# EasyEDA Pro project ministm32.eprj

# Schematic Schematic1
Create Date: 2023-02-22; Page Name: P1; Project Name: ministm32; Schematic Name: Schematic1; Update Date: 2023-02-23; Company: 嘉立创EDA; Page Size: A3; Version: V1.0
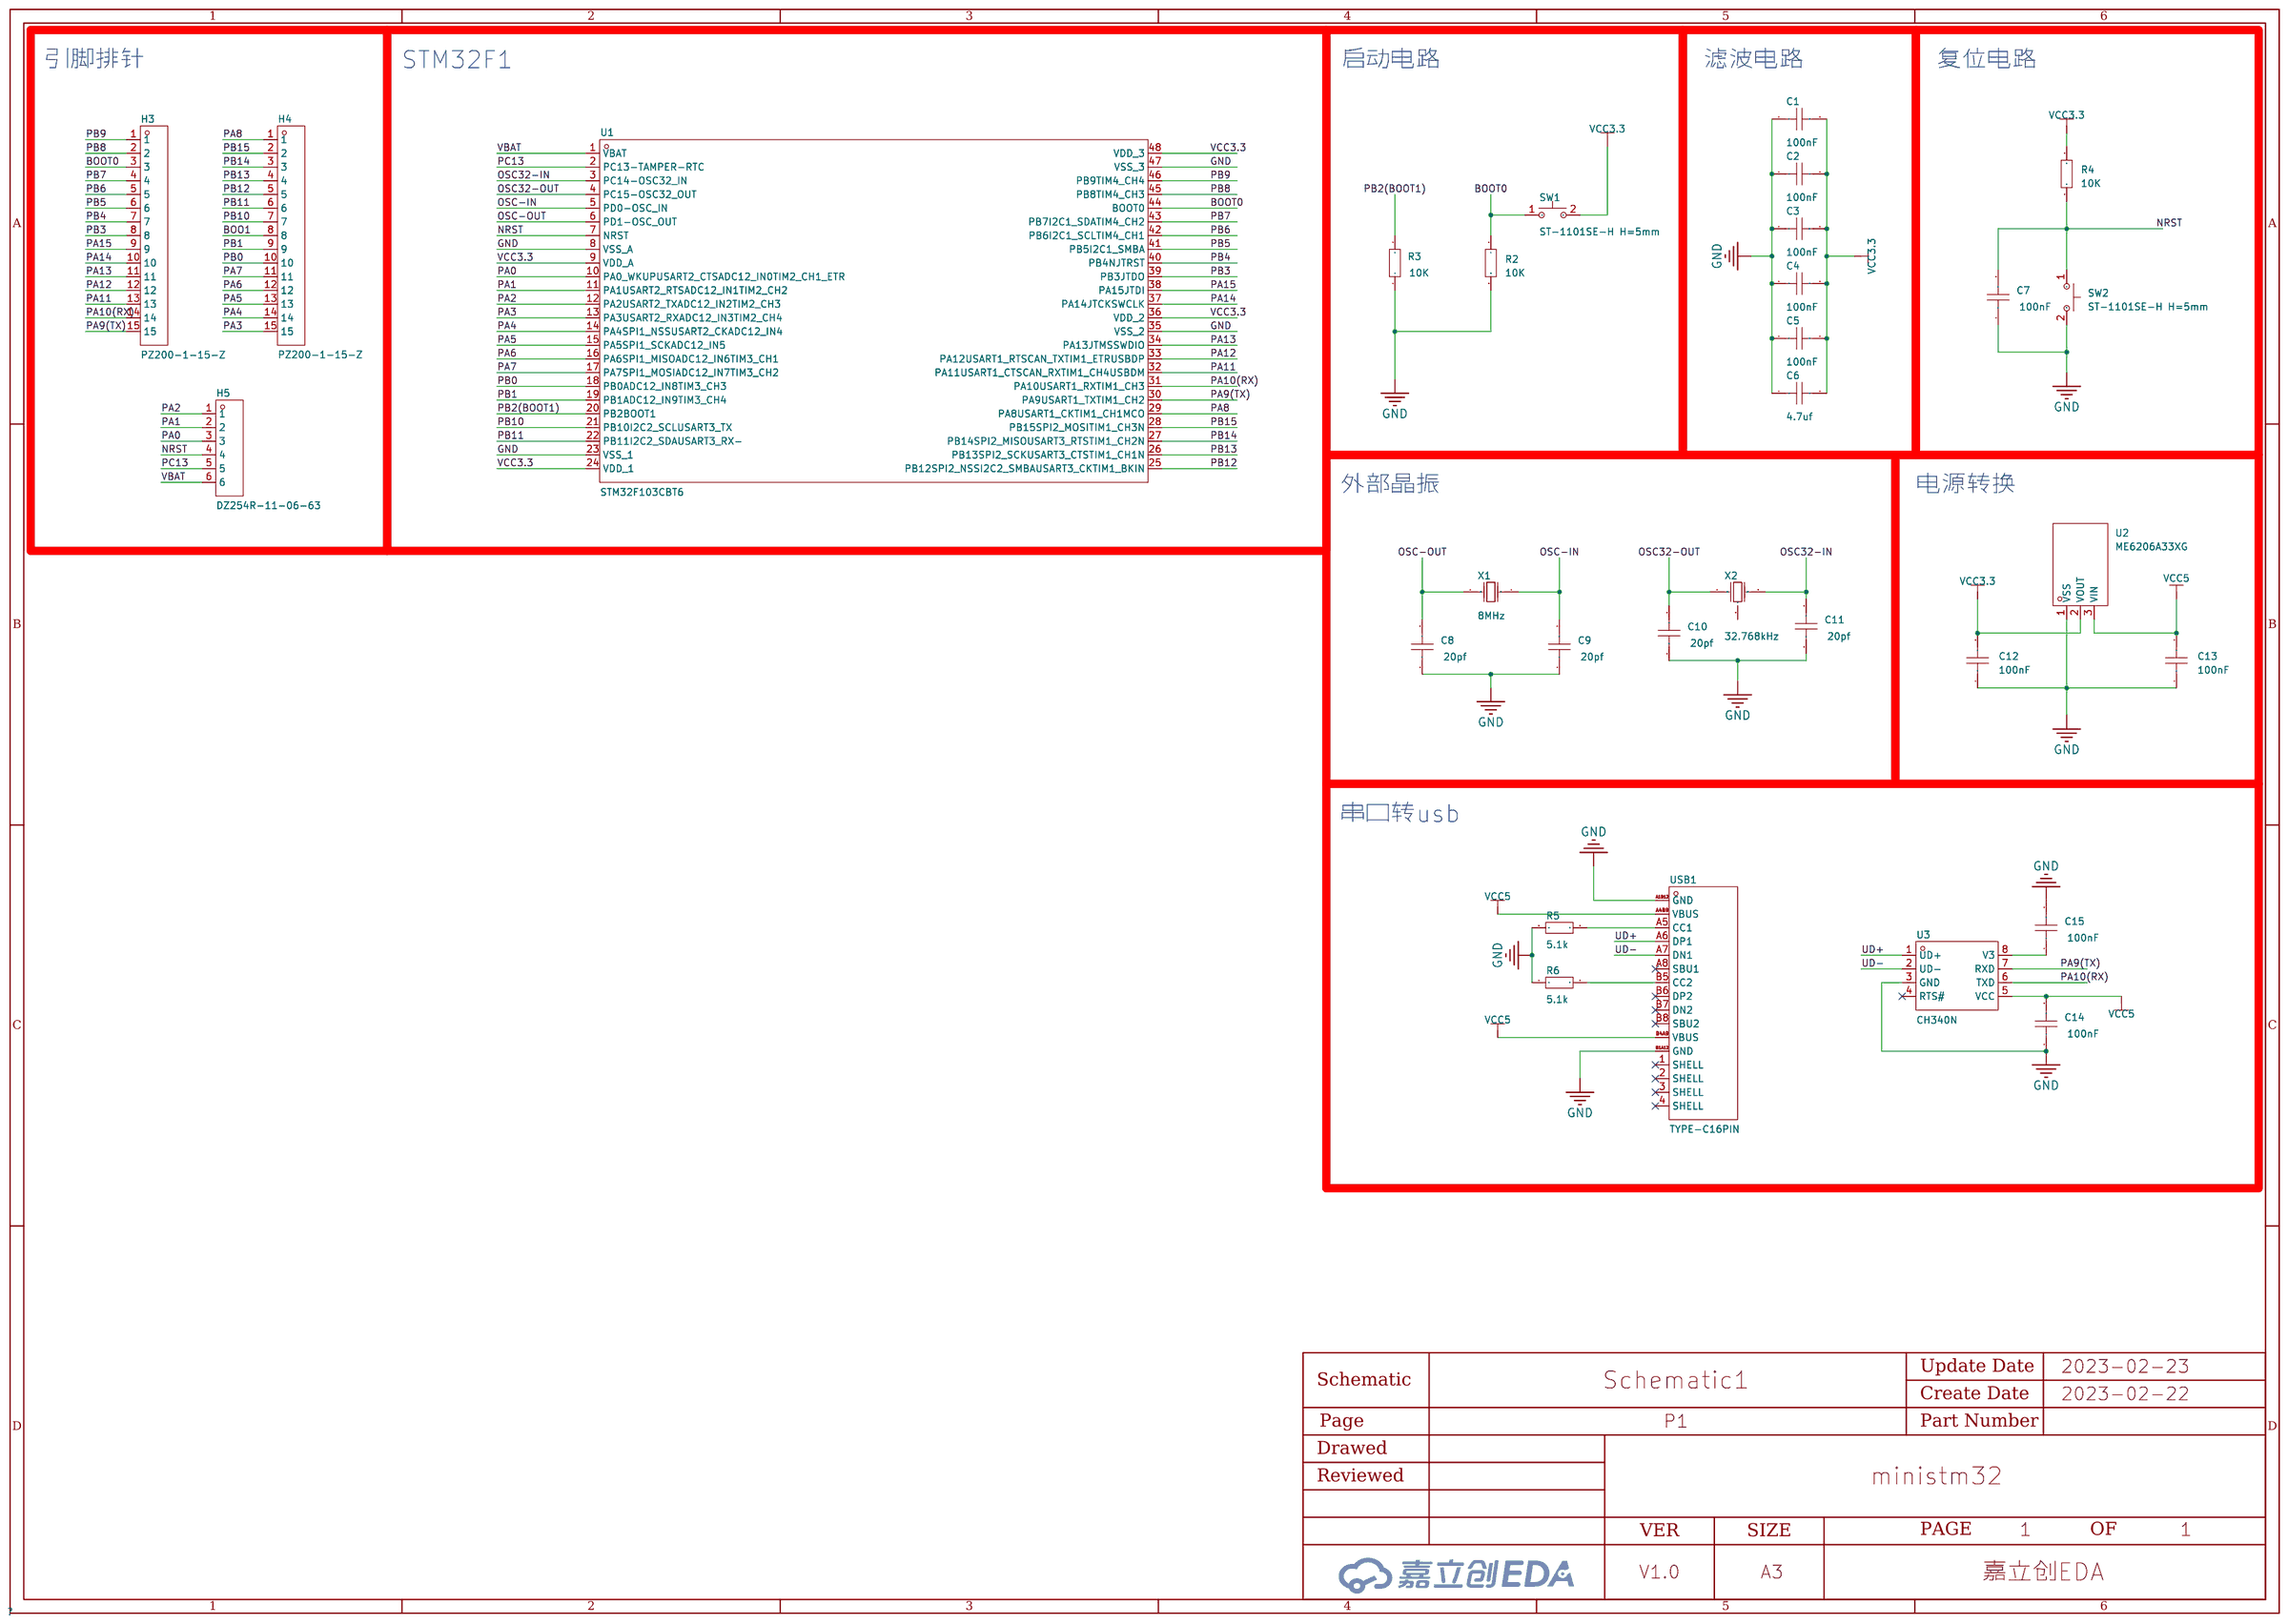
[diagram p0: schematic sheet]

## Parts
C1  100nF  [C0603]
C2  100nF  [C0603]
C3  100nF  [C0603]
C4  100nF  [C0603]
C5  100nF  [C0603]
C6  4.7uf  [C0603]
C7  100nF  [C0603]
C8  20pf  [C0603]
C9  20pf  [C0603]
C10  20pf  [C0603]
C11  20pf  [C0603]
C12  100nF  [C0603]
C13  100nF  [C0603]
C14  100nF  [C0603]
C15  100nF  [C0603]
H3  PZ200-1-15-Z  [HDR-TH_15P-P2.00-V-M]
H4  PZ200-1-15-Z  [HDR-TH_15P-P2.00-V-M]
H5  DZ254R-11-06-63  [HDR-TH_6P-P2.54-V-M]
R2  10K  [R0603]
R3  10K  [R0603]
R4  10K  [R0603]
R5  5.1k  [R0603]
R6  5.1k  [R0603]
SW1  ST-1101SE-H H=5mm  [SW-SMD_L6.1-W3.6-LS8.3-EH]
SW2  ST-1101SE-H H=5mm  [SW-SMD_L6.1-W3.6-LS8.3-EH]
U1  STM32F103CBT6  [LQFP-48_L7.0-W7.0-P0.50-LS9.0-BL]
U2  ME6206A33XG  [SOT-23-3_L2.9-W1.6-P1.90-LS2.8-BR]
U3  CH340N  [SOP-8_L4.9-W3.9-P1.27-LS6.0-BL]
USB1  TYPE-C16PIN  [USB-C-SMD_TYPE-C16PIN]
X1  8MHz  [CRYSTAL-SMD_L11.5-W4.8-LS12.7]
X2  32.768kHz  [OSC-SMD_BD2.0-P2.54_TMXLI-206F32.768KHZ12.5PF20PPM]

## Library data of the parts
C1-C15 = CAP_0603: Supplier Footprint: 0603
H3 H4 = PZ200-1-15-Z: 排数:单排;总PIN位数:15;间距:2mm;插针结构:1x15P;行距:-;安装类型:直插;圆针/方针:方针;额定电流:1.5A;额定电压:-;配合针长度:4mm;塑高:2mm;端接针长度:2.8mm;工作温度范围:-40℃~+105℃;颜色:黑色;; LCSC Part Name: 2mm 1x15P 直插 方针; Supplier Part: C2905961; Manufacturer: HCTL(华灿天禄); Supplier Footprint: 插件,P=2mm; JLCPCB Part Class: Extended Part; Datasheet: https://atta.szlcsc.com/upload/public/pdf/source/20211108/AC3702C3A38BEB816F7C5A88420883F4.pdf; Supplier: LCSC; Number of Rows: 单排; Number of Pins: 15; Pitch: 2mm; Pin Structure: 1x15P; Mounting Type: 直插; Circluar Pins/Square Pins: 方针; Current Rating (Max): 1.5A; Length of Mating Pin: 4mm; Insulation Height: 2mm; Length of End Connection Pin: 2.8mm; Operating Temperature Range: -40℃~+105℃; Color: 黑色
H5 = DZ254R-11-06-63: 排数:单排;总PIN位数:6;间距:2.54mm;插针结构:1x6P;行距:-;安装类型:直插;圆针/方针:方针;额定电流:3A;额定电压:-;配合针长度:6mm;塑高:2.54mm;端接针长度:3mm;工作温度范围:-;颜色:-;; LCSC Part Name: 2.54mm 1x6P 直插 方针; Supplier Part: C2935912; Manufacturer: DEALON(德艺隆); Supplier Footprint: 直插,P=2.54mm; JLCPCB Part Class: Extended Part; Datasheet: https://atta.szlcsc.com/upload/public/pdf/source/20211231/575FA3133C71038A037ABECAE7869EE6.pdf; Supplier: LCSC; Number of Rows: 单排; Number of Pins: 6; Pitch: 2.54mm; Pin Structure: 1x6P; Mounting Type: 直插; Circluar Pins/Square Pins: 方针; Current Rating (Max): 3A; Length of Mating Pin: 6mm; Insulation Height: 2.54mm; Length of End Connection Pin: 3mm
R2-R6 = Res_0603: Supplier Footprint: 0603
SW1 SW2 = ST-1101SE-H H=5mm: 触点电流:50mA;额定电压(DC):12V;绝缘电阻:100MΩ;电路结构:单刀单掷;安装方式:立贴;按钮形状:矩形按钮;按钮/盖帽颜色:白色;作用力:260gf@±50gf;机械寿命:30000;工作温度:-20℃~+80℃;引脚样式:鸥翼型;开关长度:6.1mm;开关宽度:3.55mm;开关高度:5mm;带支架:否;; LCSC Part Name: 轻触开关 二脚贴片带柱; Supplier Part: C695411; Manufacturer: RISHENG(日昇); Supplier Footprint: SMD; JLCPCB Part Class: Extended Part; Datasheet: https://atta.szlcsc.com/upload/public/pdf/source/20200922/C695411_2C677BE4A130A2F2802BB460DE02FC73.pdf; Supplier: LCSC; Contact Current: 50mA; Voltage Rating (DC): 12V; Insulation Resistance: 100MΩ; Circuit: 单刀单掷; Mounting Style: 立贴; Actuator Style: 矩形按钮; Actuator/Cap Color: 白色; Operating Force: 260gf@±50gf; Mechanical Life: 30000; Operating Temperature: -20℃~+80℃; Pin Style: 鸥翼型; Switch Length: 6.1mm; Switch Width: 3.55mm; Switch Height: 5mm; Strike Gundam: 否
U1 = STM32F103CBT6: CPU内核:ARM Cortex-M3;CPU最大主频:72MHz;工作电压范围:2V~3.6V;内部振荡器:有;程序 FLASH容量:128K@x8bit;RAM总容量:20KB;EEPROM/数据 FLASH容量:-;GPIO端口数量:37;ADC(单元数/通道数/位数):1@x10ch/12bit;外设/功能/协议栈:温度传感器；DMA；看门狗；POR；PWM;工作温度范围:-40℃~+85℃;; LCSC Part Name: ARM Cortex-M3 72MHz 闪存：128K@x8bit RAM：20KB; Supplier Part: C8304; Manufacturer: ST(意法半导体); Supplier Footprint: LQFP-48(7x7); JLCPCB Part Class: Extended Part; Datasheet: https://atta.szlcsc.com/upload/public/pdf/source/20140724/1457707170379.pdf; Supplier: LCSC; CPU Core: ARM Cortex-M3; Maximum Frequency: 72MHz; Supply Voltage Range: 2V~3.6V; Internal Oscillator: 有; Program FLASH Size: 128K@x8bit; RAM Size: 20KB; GPIO Ports Number: 37; ADC (Units/Channels/bits): 1@x10ch/12bit; Peripherals / Functions / Protocol Stacks: 温度传感器；DMA；看门狗；POR；PWM; Operating Temperature Range: -40℃~+85℃
U2 = ME6206A33XG: 输出类型:固定;输出极性:正;输出通道数:1;最大输入电压:6V;输出电压:3.3V;压差:400mV@(200mA);输出电流:300mA;电源纹波抑制比(PSRR):50dB@(1kHz);; LCSC Part Name: 正 Vin=6V Vout=3.3V 300mA 50dB@(1kHz); Supplier Part: C161345; Manufacturer: MICRONE(南京微盟); Supplier Footprint: SOT-23-3L; JLCPCB Part Class: Extended Part; Datasheet: https://atta.szlcsc.com/upload/public/pdf/source/20180207/C161345_15179949863651359188.pdf; Supplier: LCSC; Output Type: 固定; Output Polarity: 正; Number of Outputs: 1; Maximum Input Voltage: 6V; Output Voltage: 3.3V; Dropout Voltage: 400mV@(200mA); Output Current: 300mA; Power Supply Rejection Ratio (PSRR): 50dB@(1kHz)
U3 = CH340N: Supplier Part: C2977777; Manufacturer: WCH(南京沁恒); Supplier Footprint: SOP-8; JLCPCB Part Class: Extended Part; Datasheet: https://atta.szlcsc.com/upload/public/pdf/source/20220223/82A45E4FF89B3EDCAD50B354450A7EF4.pdf; Supplier: LCSC
USB1 = TYPE-C16PIN: 连接器类型:Type-C;标准:-;公母:母座;触点数量:16;端口数量:1;安装方式:卧贴;额定电流 - 电源:3A;工作温度范围:-40℃~+85℃;; LCSC Part Name: Type-C 母座 卧贴 快充闪充 停产; Supplier Part: C393939; Manufacturer: SHOU HAN(首韩); Supplier Footprint: SMD; JLCPCB Part Class: Extended Part; Datasheet: https://atta.szlcsc.com/upload/public/pdf/source/20190521/C393939_7B9043D4CF1026AF443AB60D91FBCD5C.pdf; Supplier: LCSC; Connector Type: Type-C; Gender: 母座; Number of Contacts: 16; Number of Ports: 1; Mounting Style: 卧贴; Current Rating - Power (Max): 3A; Operating Temperature Range: -40℃~+85℃
X1 = X49SM8MSD2SC: 晶振类型:49SMD;频率:8MHz;频率公差:±20ppm;频率稳定度:±30ppm;负载电容:20pF;工作温度:-20℃~+70℃;; LCSC Part Name: HC-49SMD 8MHz ±20ppm 20pF; Supplier Part: C12674; Manufacturer: YXC(扬兴晶振); Supplier Footprint: HC-49S-SMD-2P; JLCPCB Part Class: Basic Part; Datasheet: https://atta.szlcsc.com/upload/public/pdf/source/20210329/C106809_0E91E60850A780B284B63D653DC40EA4.pdf; Supplier: LCSC; Crystal Type: 49SMD; Frequency Tolerance: ±20ppm; Frequency Stability: ±30ppm; Load Capacitance: 20pF; Operating Temperature: -20℃~+70℃
X2 = TAXM32768KBGBAZN2T: 晶振类型:贴片无源晶振;频率:32.768kHz;频率公差:±10ppm;负载电容:12.5pF;工作温度:-;; LCSC Part Name: 32.768kHz ±10ppm 12.5pF; Supplier Part: C164061; Manufacturer: TAE(雅晶鑫); Supplier Footprint: SMD,D2xL6mm; JLCPCB Part Class: Extended Part; Datasheet: https://atta.szlcsc.com/upload/public/pdf/source/20180829/C164061_FE478386A3282FAF4C91D5A694E94402.pdf; Supplier: LCSC; Crystal Type: 贴片无源晶振; Frequency Tolerance: ±10ppm; Load Capacitance: 12.5pF

## Nets
GND: C1.1 C2.1 C3.1 C4.1 C5.1 C6.1 C7.1 C8.1 C9.1 C10.1 C11.1 C12.1 C13.1 C14.1 C15.2 R2.2 R3.1 R5.1 R6.1 SW2.2 U1.8(VSS_A) U1.23(VSS_1) U1.35(VSS_2) U1.47(VSS_3) U2.1(VSS) U3.3(GND) USB1.A1B12(GND) USB1.B1A12(GND)
VBAT: H5.6 U1.1(VBAT)
VCC3.3: C1.2 C2.2 C3.2 C4.2 C5.2 C6.2 C12.2 R4.2 SW1.2 U1.9(VDD_A) U1.24(VDD_1) U1.36(VDD_2) U1.48(VDD_3) U2.2(VOUT)
VCC5: C13.2 C14.2 U2.3(VIN) U3.5(VCC) USB1.A4B9(VBUS) USB1.B4A9(VBUS)
BOO1: H4.8
BOOT0: H3.3 R2.1 SW1.1 U1.44(BOOT0)
NRST: C7.2 H5.4 R4.1 SW2.1 U1.7(NRST)
OSC32-IN: C11.2 U1.3(PC14-OSC32_IN) X2.2(OSC2)
OSC32-OUT: C10.2 U1.4(PC15-OSC32_OUT) X2.1(OSC1)
OSC-IN: C9.2 U1.5(PD0-OSC_IN) X1.1(OSC1)
OSC-OUT: C8.2 U1.6(PD1-OSC_OUT) X1.2(OSC2)
PA0: H5.3 U1.10(PA0_WKUPUSART2_CTSADC12_IN0TIM2_CH1_ETR)
PA1: H5.2 U1.11(PA1USART2_RTSADC12_IN1TIM2_CH2)
PA2: H5.1 U1.12(PA2USART2_TXADC12_IN2TIM2_CH3)
PA3: H4.15 U1.13(PA3USART2_RXADC12_IN3TIM2_CH4)
PA4: H4.14 U1.14(PA4SPI1_NSSUSART2_CKADC12_IN4)
PA5: H4.13 U1.15(PA5SPI1_SCKADC12_IN5)
PA6: H4.12 U1.16(PA6SPI1_MISOADC12_IN6TIM3_CH1)
PA7: H4.11 U1.17(PA7SPI1_MOSIADC12_IN7TIM3_CH2)
PA8: H4.1 U1.29(PA8USART1_CKTIM1_CH1MCO)
PA9(TX): H3.15 U1.30(PA9USART1_TXTIM1_CH2) U3.7(RXD)
PA10(RX): H3.14 U1.31(PA10USART1_RXTIM1_CH3) U3.6(TXD)
PA11: H3.13 U1.32(PA11USART1_CTSCAN_RXTIM1_CH4USBDM)
PA12: H3.12 U1.33(PA12USART1_RTSCAN_TXTIM1_ETRUSBDP)
PA13: H3.11 U1.34(PA13JTMSSWDIO)
PA14: H3.10 U1.37(PA14JTCKSWCLK)
PA15: H3.9 U1.38(PA15JTDI)
PB0: H4.10 U1.18(PB0ADC12_IN8TIM3_CH3)
PB1: H4.9 U1.19(PB1ADC12_IN9TIM3_CH4)
PB2(BOOT1): R3.2 U1.20(PB2BOOT1)
PB3: H3.8 U1.39(PB3JTDO)
PB4: H3.7 U1.40(PB4NJTRST)
PB5: H3.6 U1.41(PB5I2C1_SMBA)
PB6: H3.5 U1.42(PB6I2C1_SCLTIM4_CH1)
PB7: H3.4 U1.43(PB7I2C1_SDATIM4_CH2)
PB8: H3.2 U1.45(PB8TIM4_CH3)
PB9: H3.1 U1.46(PB9TIM4_CH4)
PB10: H4.7 U1.21(PB10I2C2_SCLUSART3_TX)
PB11: H4.6 U1.22(PB11I2C2_SDAUSART3_RX-)
PB12: H4.5 U1.25(PB12SPI2_NSSI2C2_SMBAUSART3_CKTIM1_BKIN)
PB13: H4.4 U1.26(PB13SPI2_SCKUSART3_CTSTIM1_CH1N)
PB14: H4.3 U1.27(PB14SPI2_MISOUSART3_RTSTIM1_CH2N)
PB15: H4.2 U1.28(PB15SPI2_MOSITIM1_CH3N)
PC13: H5.5 U1.2(PC13-TAMPER-RTC)
UD+: U3.1(UD+) USB1.A6(DP1)
UD-: U3.2(UD-) USB1.A7(DN1)
$1N10863: C15.1 U3.8(V3)
$1N14156: R5.2 USB1.A5(CC1)
$1N14185: R6.2 USB1.B5(CC2)

Not connected (* = marked no-connect by the designer): U3 4(RTS#)*; USB1 1(SHELL)* 2(SHELL)* 3(SHELL)* 4(SHELL)* A8(SBU1)* B6(DP2)* B7(DN2)* B8(SBU2)*; X2 3

## Notes on the sheet
- 引脚排针
- STM32F1
- 启动电路
- 滤波电路
- 复位电路
- 外部晶振
- 电源转换
- 串口转usb

# Board PCB1
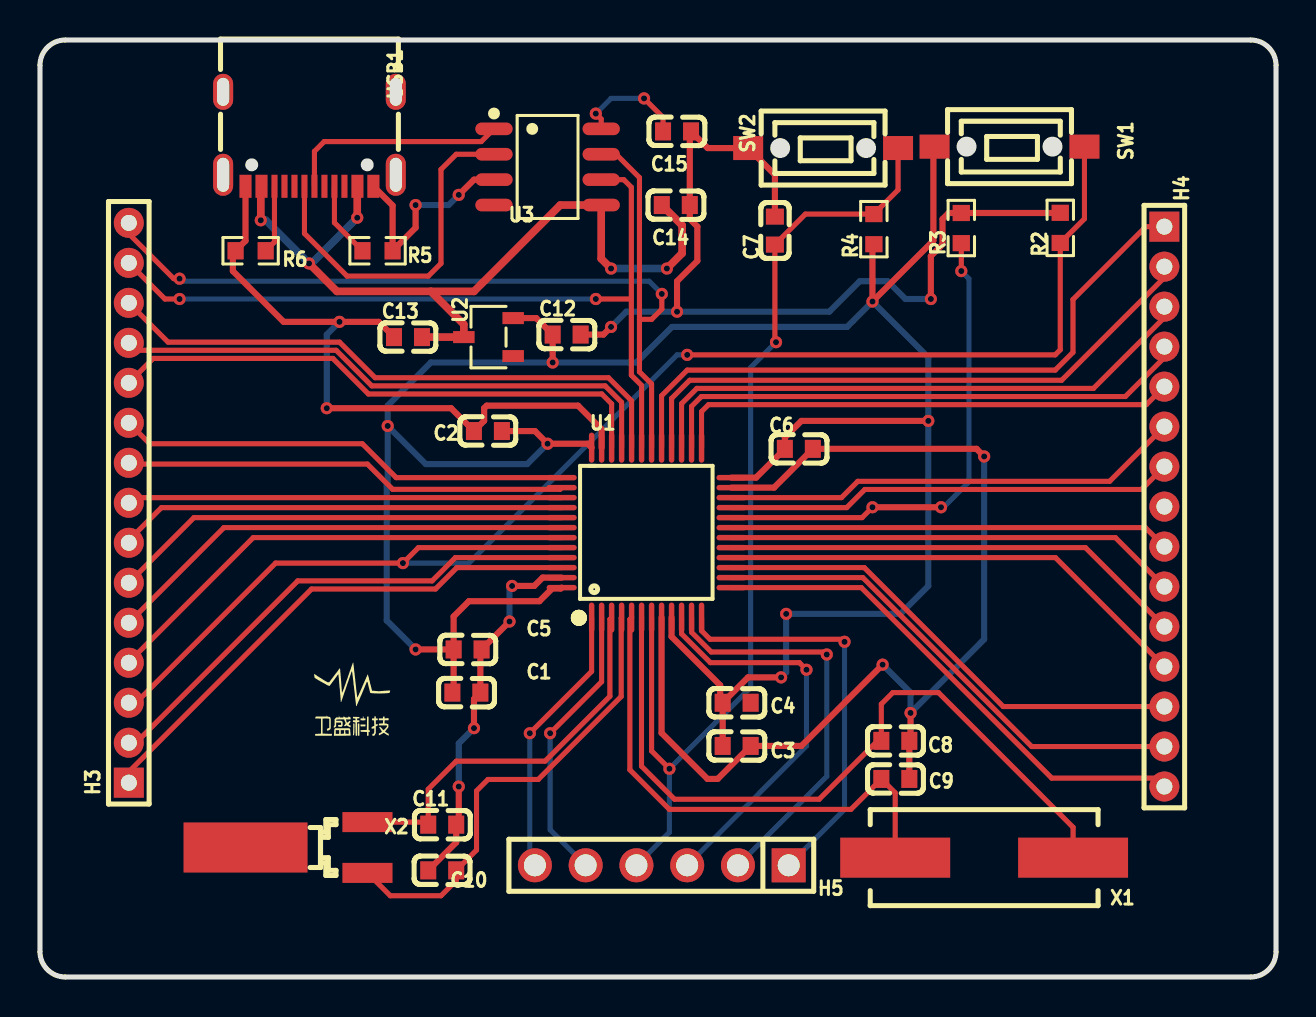
[diagram p1: board, top side]
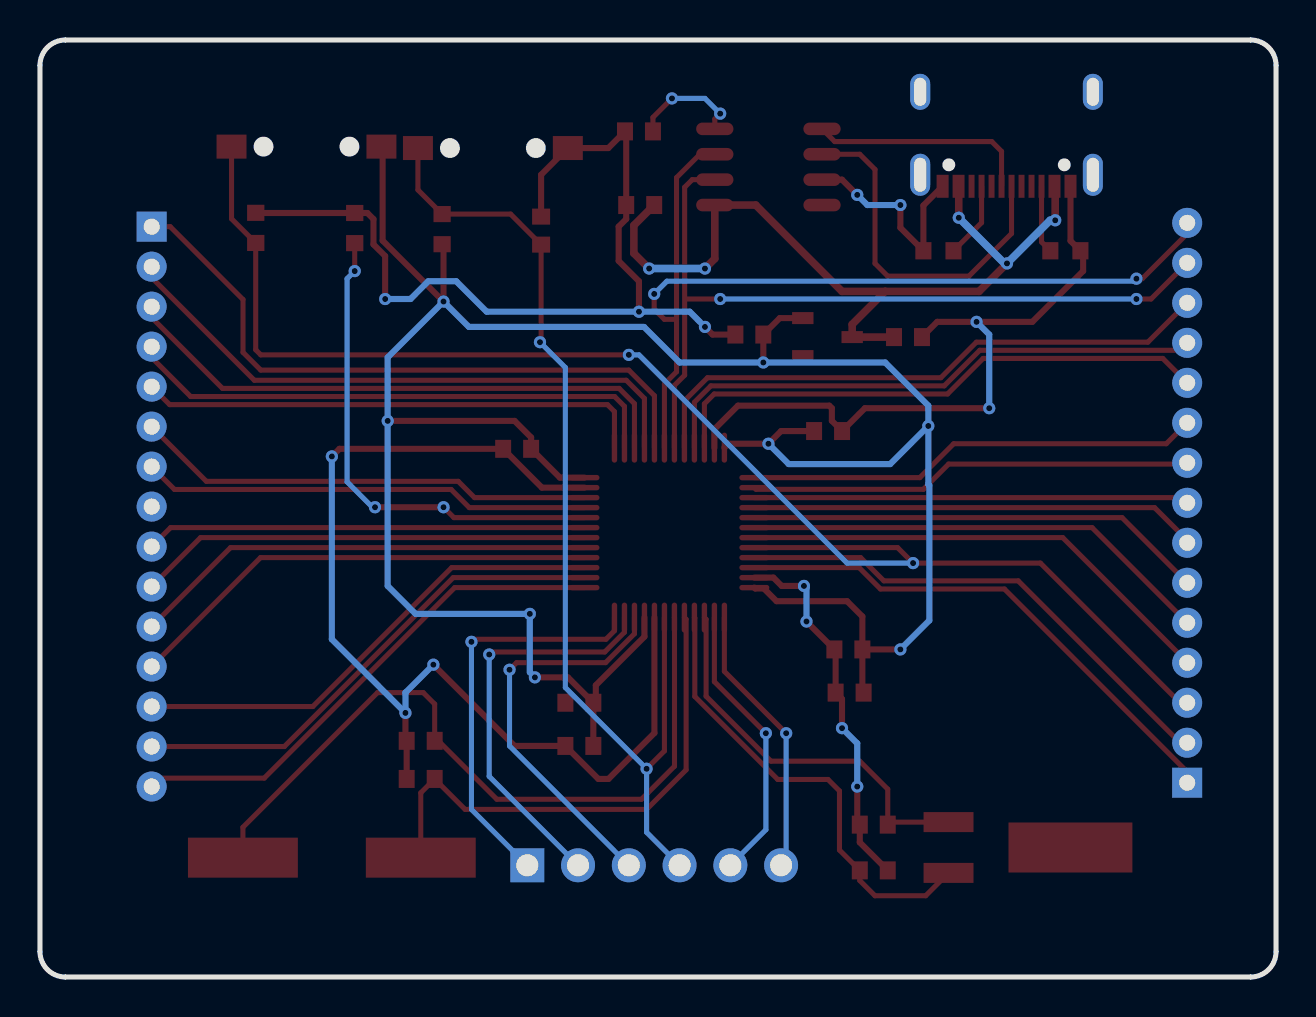
[diagram p2: board, bottom side, seen from below]

Outline 61.85 x 46.86 mm; copper layers: Top Layer, Bottom Layer. Coordinates in mm from the lower left corner of the outline.
Outline path: 0,45.59 0,1.27 arc(0.37,0.37) 1.27,0 60.58,0 arc(61.48,0.37) 61.85,1.27 61.85,45.59 arc(61.48,46.49) 60.58,46.86 1.27,46.86 arc(0.37,46.49) 0,45.59
Stack: Top Layer 0.035mm / Dielectric1 1.51mm FR4 er 4.5 / Bottom Layer 0.035mm

## Design rules (mm)
spacing safeClearance (default): track to track 0.152, other pairs 0.152 to 0.3
track width trackWidth (default): min 0.127, default 0.254, max 2.54
track width POWER: min 0.127, default 0.381, max 2.54
differential pair differentialPair (default): width min 0.127, default 0.254, max 2.54; gap min 0.152, default 0.152
via viaSize (default): diameter min 0.5, default 0.61, max 10; hole min 0.3, default 0.305, max 6
net VCC3.3 uses POWER
net VCC5 uses POWER

## Placement (name value [footprint] x y rotation side)
C1  100nF  [C0603]  21.34 14.22 180 top
C2  100nF  [C0603]  22.41 27.3 0 top
C3  100nF  [C0603]  34.86 11.56 180 top
C4  100nF  [C0603]  34.86 13.72 180 top
C5  100nF  [C0603]  21.4 16.38 180 top
C6  4.7uf  [C0603]  37.97 26.42 180 top
C7  100nF  [C0603]  36.77 37.33 270 top
C8  20pf  [C0603]  42.8 11.81 180 top
C9  20pf  [C0603]  42.8 9.91 180 top
C10  20pf  [C0603]  20.13 5.33 0 top
C11  20pf  [C0603]  20.13 7.62 180 top
C12  100nF  [C0603]  26.35 32.13 180 top
C13  100nF  [C0603]  18.42 32 0 top
C14  100nF  [C0603]  31.82 38.61 180 top
C15  100nF  [C0603]  31.88 42.29 0 top
H3  PZ200-1-15-Z  [HDR-TH_15P-P2.00-V-M]  4.45 23.72 90 top
H4  PZ200-1-15-Z  [HDR-TH_15P-P2.00-V-M]  56.26 23.53 270 top
H5  DZ254R-11-06-63  [HDR-TH_6P-P2.54-V-M]  31.11 5.59 180 top
R2  10K  [R0603]  51.05 37.47 90 top
R3  10K  [R0603]  46.1 37.46 270 top
R4  10K  [R0603]  41.73 37.4 270 top
R5  5.1k  [R0603]  16.89 36.32 180 top
R6  5.1k  [R0603]  10.54 36.32 0 top
SW1  ST-1101SE-H H=5mm  [SW-SMD_L6.1-W3.6-LS8.3-EH]  48.51 41.53 180 top
SW2  ST-1101SE-H H=5mm  [SW-SMD_L6.1-W3.6-LS8.3-EH]  39.19 41.46 180 top
U1  STM32F103CBT6  [LQFP-48_L7.0-W7.0-P0.50-LS9.0-BL]  30.35 22.22 0 top
U2  ME6206A33XG  [SOT-23-3_L2.9-W1.6-P1.90-LS2.8-BR]  22.44 32 0 top
U3  CH340N  [SOP-8_L4.9-W3.9-P1.27-LS6.0-BL]  25.4 40.51 270 top
USB1  TYPE-C16PIN  [USB-C-SMD_TYPE-C16PIN]  13.48 41.91 180 top
X1  8MHz  [CRYSTAL-SMD_L11.5-W4.8-LS12.7]  47.24 5.97 0 top
X2  32.768kHz  [OSC-SMD_BD2.0-P2.54_TMXLI-206F32.768KHZ12.5PF20PPM]  13.34 6.48 0 top

## Footprints (pads in the part's own frame, mm; a bottom-side part is the same pattern mirrored in y, then rotated)
C0603
  rect 0.8x0.9 smd: 1(-0.7,0) 2(0.7,0)
CRYSTAL-SMD_L11.5-W4.8-LS12.7
  rect 5.5x2 smd: 1(-4.45,0) 2(4.45,0)
HDR-TH_6P-P2.54-V-M
  rect 1.7x1.7 hole 1.1: 1(-6.35,0)
  round 1.7 hole 1.1: 2(-3.81,0) 3(-1.27,0) 4(1.27,0) 5(3.81,0) 6(6.35,0)
HDR-TH_15P-P2.00-V-M
  rect 1.5x1.5 hole 0.8: 1(-14,0)
  round 1.5 hole 0.8: 2(-12,0) 3(-10,0) 4(-8,0) 5(-6,0) 6(-4,0) 7(-2,0) 8(0,0) 9(2,0) 10(4,0) 11(6,0) 12(8,0) 13(10,0) 14(12,0) 15(14,0)
LQFP-48_L7.0-W7.0-P0.50-LS9.0-BL
  oval 0.27x1.5 smd: 1(-2.75,-4.25) 2(-2.25,-4.25) 3(-1.75,-4.25) 4(-1.25,-4.25) 5(-0.75,-4.25) 6(-0.25,-4.25) 7(0.25,-4.25) 8(0.75,-4.25) 9(1.25,-4.25) 10(1.75,-4.25) 11(2.25,-4.25) 12(2.75,-4.25) 25(2.75,4.25) 26(2.25,4.25) 27(1.75,4.25) 28(1.25,4.25) 29(0.75,4.25) 30(0.25,4.25) 31(-0.25,4.25) 32(-0.75,4.25) 33(-1.25,4.25) 34(-1.75,4.25) 35(-2.25,4.25) 36(-2.75,4.25)
  oval 1.5x0.27 smd: 13(4.25,-2.75) 14(4.25,-2.25) 15(4.25,-1.75) 16(4.25,-1.25) 17(4.25,-0.75) 18(4.25,-0.25) 19(4.25,0.25) 20(4.25,0.75) 21(4.25,1.25) 22(4.25,1.75) 23(4.25,2.25) 24(4.25,2.75) 37(-4.25,2.75) 38(-4.25,2.25) 39(-4.25,1.75) 40(-4.25,1.25) 41(-4.25,0.75) 42(-4.25,0.25) 43(-4.25,-0.25) 44(-4.25,-0.75) 45(-4.25,-1.25) 46(-4.25,-1.75) 47(-4.25,-2.25) 48(-4.25,-2.75)
OSC-SMD_BD2.0-P2.54_TMXLI-206F32.768KHZ12.5PF20PPM
  rect 2.5x1 smd: 1(3.05,-1.27) 2(3.05,1.27)
  rect 6.2x2.5 smd: 3(-3.05,0)
R0603
  rect 0.806x0.864 smd: 1(-0.753,0) 2(0.753,0)
SOP-8_L4.9-W3.9-P1.27-LS6.0-BL
  oval 0.63x1.865 smd: 1(-1.905,-2.683) 2(-0.635,-2.683) 3(0.635,-2.683) 4(1.905,-2.683) 5(1.905,2.683) 6(0.635,2.683) 7(-0.635,2.683) 8(-1.905,2.683)
SOT-23-3_L2.9-W1.6-P1.90-LS2.8-BR
  rect 1.07x0.6 smd: 1(1.235,-0.95) 2(1.235,0.95) 3(-1.235,0)
SW-SMD_L6.1-W3.6-LS8.3-EH
  rect 1.5x1.2 smd: 1(-3.75,0) 2(3.75,0)
USB-C-SMD_TYPE-C16PIN
  oval 1x2.1 hole 0.6x1.7: 1(-4.32,1.788) 2(4.32,1.788)
  oval 1x1.8 hole 0.6x1.4: 3(-4.32,-2.362) 4(4.32,-2.362)
  rect 0.6x1.15 smd: A1B12(-3.2,2.362) A4B9(-2.4,2.362) B1A12(3.2,2.362) B4A9(2.4,2.362)
  rect 0.3x1.15 smd: A5(-1.25,2.362) A6(-0.25,2.362) A7(0.25,2.362) A8(-1.75,2.362) B5(1.75,2.362) B6(0.75,2.362) B7(-0.75,2.362) B8(1.25,2.362)

## Nets
As in the schematic.

Pads without a net: U3 4; USB1 1 2 3 4 A8 B6 B7 B8; X2 3

## Via types
v1: diameter 0.61, hole 0.305, Top Layer to Bottom Layer, 45 vias

## Routing (per net, layer and track width the routed paths; a pad name or vN(x,y) marks a point on that pad's centre or on a via; arc(x,y) is an arc through that point)
GND: length 165
  Top Layer w0.305: v1(23.62,19.56) 24.73,19.56 25.15,19.97 U1.47 ; v1(28.58,32.51) 28.19,32.13 C12.1 ; v1(42.16,15.62) 38.1,11.56 35.56,11.56 33.91,9.91 33.4,9.91 31.1,12.2 U1.8 ; v1(23.5,17.78) C5.1 22.04,16.32 22.04,14.22 21.72,13.91 v1(21.72,12.45) ; USB1.A1B12 17.64,38.59 R5.1 18.8,37.47 v1(18.8,38.61) ; C9.1 C8.1 43.56,11.87 v1(43.56,13.21) ; U1.35 28.1,27.4 26.92,28.57 22.35,28.57 22.23,28.45 22.23,27.82 C2.1 20.57,28.45 v1(14.35,28.45) ; R2.2 51.05,38.21 R3.1 45.47,38.21 45.16,37.91 45.16,36.64 44.58,36.06 v1(44.58,33.91) ; v1(47.24,26.03) 46.86,26.42 C6.1 36.73,24.47 U1.23 ; C10.1 20.83,6.73 20.83,7.62 20.95,7.75 v1(20.95,9.52) ; USB1.B1A12 10.28,36.82 R6.1 9.65,36.19 9.65,35.31 12.19,32.77 v1(14.99,32.77) 16.95,32.77 C13.1 ; v1(31.88,33.27) 31.88,34.8 32.89,35.81 32.89,37.53 32.52,37.91 C14.1 32.52,42.23 C15.2 33.41,41.46 SW2.2 36.77,40.12 C7.1 ; U3.3 21.72,39.88 v1(20.95,39.12)
  Bottom Layer w0.305: v1(23.5,17.78) 23.5,19.43 v1(23.62,19.56) ; v1(47.24,26.03) 47.24,16.89 v1(43.56,13.21) 43.56,14.22 v1(42.16,15.62) ; v1(20.95,9.52) 20.95,11.68 v1(21.72,12.45) ; v1(20.95,39.12) 20.45,38.61 v1(18.8,38.61) ; v1(14.99,32.77) 14.35,32.13 v1(14.35,28.45) ; v1(44.58,33.91) 43.31,33.91 42.42,34.8 41.02,34.8 39.5,33.27 v1(31.88,33.27) 29.34,33.27 v1(28.58,32.51)
VBAT: length 13.8
  Top Layer w0.254: v1(24.51,12.19) 27.6,15.28 U1.1
  Bottom Layer w0.254: H5.6 24.51,5.84 v1(24.51,12.19)
VCC3.3: length 129.3
  Top Layer w0.305: 20.7,16.38 20.7,18.03 21.46,18.8 24.99,18.8 25.63,19.43 26.06,19.43 U1.48 ; 20.7,16.38 20.7,14.29 C1.2 ; 20.7,16.38 v1(18.8,16.38) ; v1(44.45,27.81) 38.1,27.81 37.27,26.99 C6.2 35.83,24.97 U1.24 ; SW1.2 44.7,41.47 44.7,36.83 v1(41.66,33.78) 41.66,36.58 R4.2 ; U2.2 24.83,32.95 C12.2 v1(25.65,30.73) ; C4.2 34.04,13.84 34.04,14.59 31.6,17.02 U1.9 ; C4.2 35.43,14.99 v1(37.08,14.99) ; C4.2 C3.2 ; C2.2 24.77,27.3 v1(25.4,26.67) 27.41,26.67 U1.36
  Bottom Layer w0.305: v1(18.8,16.38) 17.35,17.83 17.35,24.59 17.4,24.64 v1(17.4,27.56) ; v1(25.4,26.67) 24.38,25.65 19.3,25.65 v1(17.4,27.56) ; v1(17.4,27.56) 17.4,28.57 19.56,30.73 v1(25.65,30.73) 29.85,30.73 31.62,32.51 40.39,32.51 v1(41.66,33.78) 44.45,30.99 v1(44.45,27.81) 44.45,19.56 43.05,18.16 v1(37.34,18.16) 37.34,15.24 v1(37.08,14.99)
VCC5: length 42.1
  Top Layer w0.381: v1(11.05,37.85) 11.05,39.51 USB1.B4A9 ; C13.2 U2.3 21.21,32.64 19.56,34.29 ; C14.2 32.13,37.59 32.13,36.19 v1(31.37,35.43) ; v1(13.46,35.69) 14.86,34.29 19.56,34.29 ; 19.56,34.29 21.72,34.29 26.04,38.61 U3.5 28.08,35.93 v1(28.58,35.43) ; USB1.A4B9 15.88,39.54 v1(15.88,37.97)
  Bottom Layer w0.381: v1(31.37,35.43) v1(28.58,35.43) ; v1(11.05,37.85) 11.3,37.85 v1(13.46,35.69) 13.59,35.69 v1(15.88,37.97)
BOOT0: length 72.8
  Top Layer w0.254: U1.44 18.94,21.47 v1(18.16,20.7) 11.79,20.7 4.81,13.72 H3.3 ; SW1.1 52.26,37.92 R2.1 51.05,31.37 50.8,31.11 v1(32.39,31.11)
  Bottom Layer w0.254: v1(32.39,31.11) 31.88,31.11 21.46,20.7 v1(18.16,20.7)
NRST: length 51.3
  Top Layer w0.254: SW2.1 42.94,39.37 R4.1 38.3,38.16 C7.2 36.77,31.81 v1(36.83,31.75) ; U1.7 30.6,11.31 v1(31.5,10.41)
  Bottom Layer w0.254: v1(36.83,31.75) 35.56,30.48 35.56,14.48 v1(31.5,10.41) 31.5,7.24 H5.4
OSC32-IN: length 19.9
  Top Layer w0.254: X2.2 19.3,7.75 C11.2 19.43,9.39 20.83,10.8 25.27,10.8 28.52,14.04 28.52,17.89 U1.3
OSC32-OUT: length 23.3
  Top Layer w0.254: U1.4 29.08,17.95 29.08,14.03 24.93,9.88 22.42,9.88 21.84,9.31 21.84,6.35 20.83,5.33 20.83,4.83 20.07,4.06 17.53,4.06 X2.1
OSC-IN: length 25.9
  Top Layer w0.254: U1.5 29.52,17.89 29.52,10.36 31.5,8.38 40.58,8.38 C9.2 42.79,9.21 42.79,5.97
OSC-OUT: length 37.3
  Top Layer w0.254: X1.2 51.69,7.49 44.96,14.22 42.67,14.22 42.1,13.65 C8.2 41.91,11.81 38.99,8.89 31.75,8.89 30.1,10.54 30.1,17.97 U1.6
PA0: length 20.1
  Top Layer w0.254: U1.10 32.1,17.17 33.55,15.72 38,15.72 v1(38.35,15.37)
  Bottom Layer w0.254: H5.3 38.35,11.56 v1(38.35,15.37)
PA1: length 20.3
  Top Layer w0.254: v1(39.37,16.13) 39.24,16.26 33.59,16.26 32.6,17.24 U1.11
  Bottom Layer w0.254: H5.2 39.37,10.03 v1(39.37,16.13)
PA2: length 20.4
  Top Layer w0.254: U1.12 33.1,17.32 33.53,16.89 40.13,16.89 v1(40.26,16.76)
  Bottom Layer w0.254: v1(40.26,16.76) 40.26,8.38 H5.1
PA3: length 25.8
  Top Layer w0.254: U1.13 41.1,19.47 50.63,9.95 55.84,9.95 H4.15
PA4: length 25.2
  Top Layer w0.254: H4.14 49.62,11.53 41.17,19.97 U1.14
PA5: length 24.5
  Top Layer w0.254: H4.13 48.2,13.53 41.25,20.47 U1.15
PA6: length 23.9
  Top Layer w0.254: U1.16 50.81,20.97 H4.12
PA7: length 23.3
  Top Layer w0.254: H4.11 52.31,21.47 U1.17
PA8: length 32.8
  Top Layer w0.254: H4.1 55.33,37.53 51.69,33.88 51.69,31.24 50.8,30.35 32.39,30.35 31.1,29.07 U1.29
PA9(TX): length 46.7
  Top Layer w0.254: U1.30 30.6,29.66 30,30.27 30,32.89 ; U3.7 28.83,41.15 30,39.98 30,32.89 ; 30,32.89 30.61,32.89 31.11,33.4 v1(31.11,34.16) ; v1(6.98,34.92) 6.69,34.92 4.45,37.17 H3.15
  Bottom Layer w0.254: v1(6.98,34.92) 7.11,34.8 30.48,34.8 v1(31.11,34.16)
PA10(RX): length 40.8
  Top Layer w0.254: v1(27.81,33.91) 29.57,33.91 ; U1.31 30.1,29.59 29.59,30.1 29.59,39.5 29.21,39.88 U3.6 ; H3.14 6.25,33.91 v1(6.98,33.91)
  Bottom Layer w0.254: v1(6.98,33.91) v1(27.81,33.91)
PA11: length 29.5
  Top Layer w0.254: H3.13 6.41,31.75 14.99,31.75 16.77,29.97 28.45,29.97 29.6,28.82 U1.32
PA12: length 28.2
  Top Layer w0.254: H3.12 4.82,31.34 14.82,31.34 16.6,29.57 28.28,29.57 29.1,28.74 U1.33
PA13: length 27.8
  Top Layer w0.254: U1.34 28.6,28.67 28.11,29.16 16.43,29.16 14.66,30.94 5.67,30.94 H3.11
PA14: length 22.8
  Top Layer w0.254: U1.37 17.82,24.97 16.13,26.67 5.49,26.67 H3.10
PA15: length 22.2
  Top Layer w0.254: H3.9 4.51,25.65 16.38,25.65 17.65,24.39 26.02,24.39 U1.38
PB0: length 22.7
  Top Layer w0.254: U1.18 53.81,21.97 H4.10
PB1: length 22.1
  Top Layer w0.254: H4.9 55.31,22.47 U1.19
PB2(BOOT1): length 24.7
  Top Layer w0.254: v1(41.66,23.49) 41.14,22.97 U1.20 ; v1(46.1,35.31) 46.1,36.7
  Top Layer w0.305: v1(41.66,23.49) v1(45.08,23.49)
  Bottom Layer w0.254: 45.21,23.49 46.48,24.77 46.48,34.92 v1(46.1,35.31)
  Bottom Layer w0.305: v1(45.08,23.49) 45.21,23.49
PB3: length 21.8
  Top Layer w0.254: H3.8 4.7,23.97 U1.39
PB4: length 22.5
  Top Layer w0.254: U1.40 6.08,23.47 4.45,21.84 H3.7
PB5: length 23
  Top Layer w0.254: H3.6 7.7,22.97 U1.41
PB6: length 23.6
  Top Layer w0.254: H3.5 9.2,22.47 U1.42
PB7: length 24.3
  Top Layer w0.254: H3.4 4.45,15.75 10.67,21.97 U1.43
PB8: length 25.5
  Top Layer w0.254: H3.2 4.8,11.72 12.9,19.81 19.62,19.81 20.79,20.97 U1.45
PB9: length 26.4
  Top Layer w0.254: H3.1 4.45,10.26 13.59,19.41 19.79,19.41 20.86,20.47 U1.46
PB10: length 22.5
  Top Layer w0.254: H4.7 55.12,24.38 41.27,24.38 40.37,23.47 U1.21
PB11: length 23.1
  Top Layer w0.254: H4.6 53.52,24.79 40.92,24.79 40.1,23.97 U1.22
PB12: length 25.5
  Top Layer w0.254: H4.5 55.36,28.63 33.45,28.63 33.1,28.28 U1.25
PB13: length 27.3
  Top Layer w0.254: U1.26 32.6,28.54 33.1,29.03 54.31,29.03 56.26,30.98 H4.4
PB14: length 28.7
  Top Layer w0.254: H4.3 56.26,32.98 52.72,29.44 32.87,29.44 32.1,28.67 U1.27
PB15: length 30.2
  Top Layer w0.254: H4.2 56.26,34.98 51.12,29.84 32.51,29.84 31.6,28.94 U1.28
PC13: length 14.2
  Top Layer w0.254: v1(25.53,12.19) 28.1,14.77 U1.2
  Bottom Layer w0.254: v1(25.53,12.19) 25.53,7.37 H5.5
UD+: length 11.2
  Top Layer w0.254: U3.1 22.08,41.78 14.22,41.78 13.73,41.29 13.73,39.55
UD-: length 18
  Top Layer w0.254: U3.2 20.83,41.15 20.07,40.39 20.07,35.69 19.43,35.05 15.37,35.05 13.23,37.18 USB1.A7
$1N10863: length 5.6
  Top Layer w0.254: v1(27.81,43.18) 28.08,42.91 U3.8 ; v1(30.23,43.94) 31.18,42.99 C15.1
  Bottom Layer w0.254: v1(27.81,43.18) 28.58,43.94 v1(30.23,43.94)
$1N14156: length 3.8
  Top Layer w0.254: R5.2 14.73,37.73 14.73,39.55
$1N14185: length 3.4
  Top Layer w0.254: R6.2 11.73,36.76 11.73,39.55

## Copper pours and planes (outline as drawn; the poured copper is in the pictures)
GND on Top Layer: -2.16,49.02 64.39,49.02 64.39,-3.56 -2.16,-3.56

Small or netless copper shapes (teardrops, artwork), in the pictures only: 1 on Top Layer
